# EAGLE schematic freebus_grundschaltung-transmitter (EAGLE 5.03)
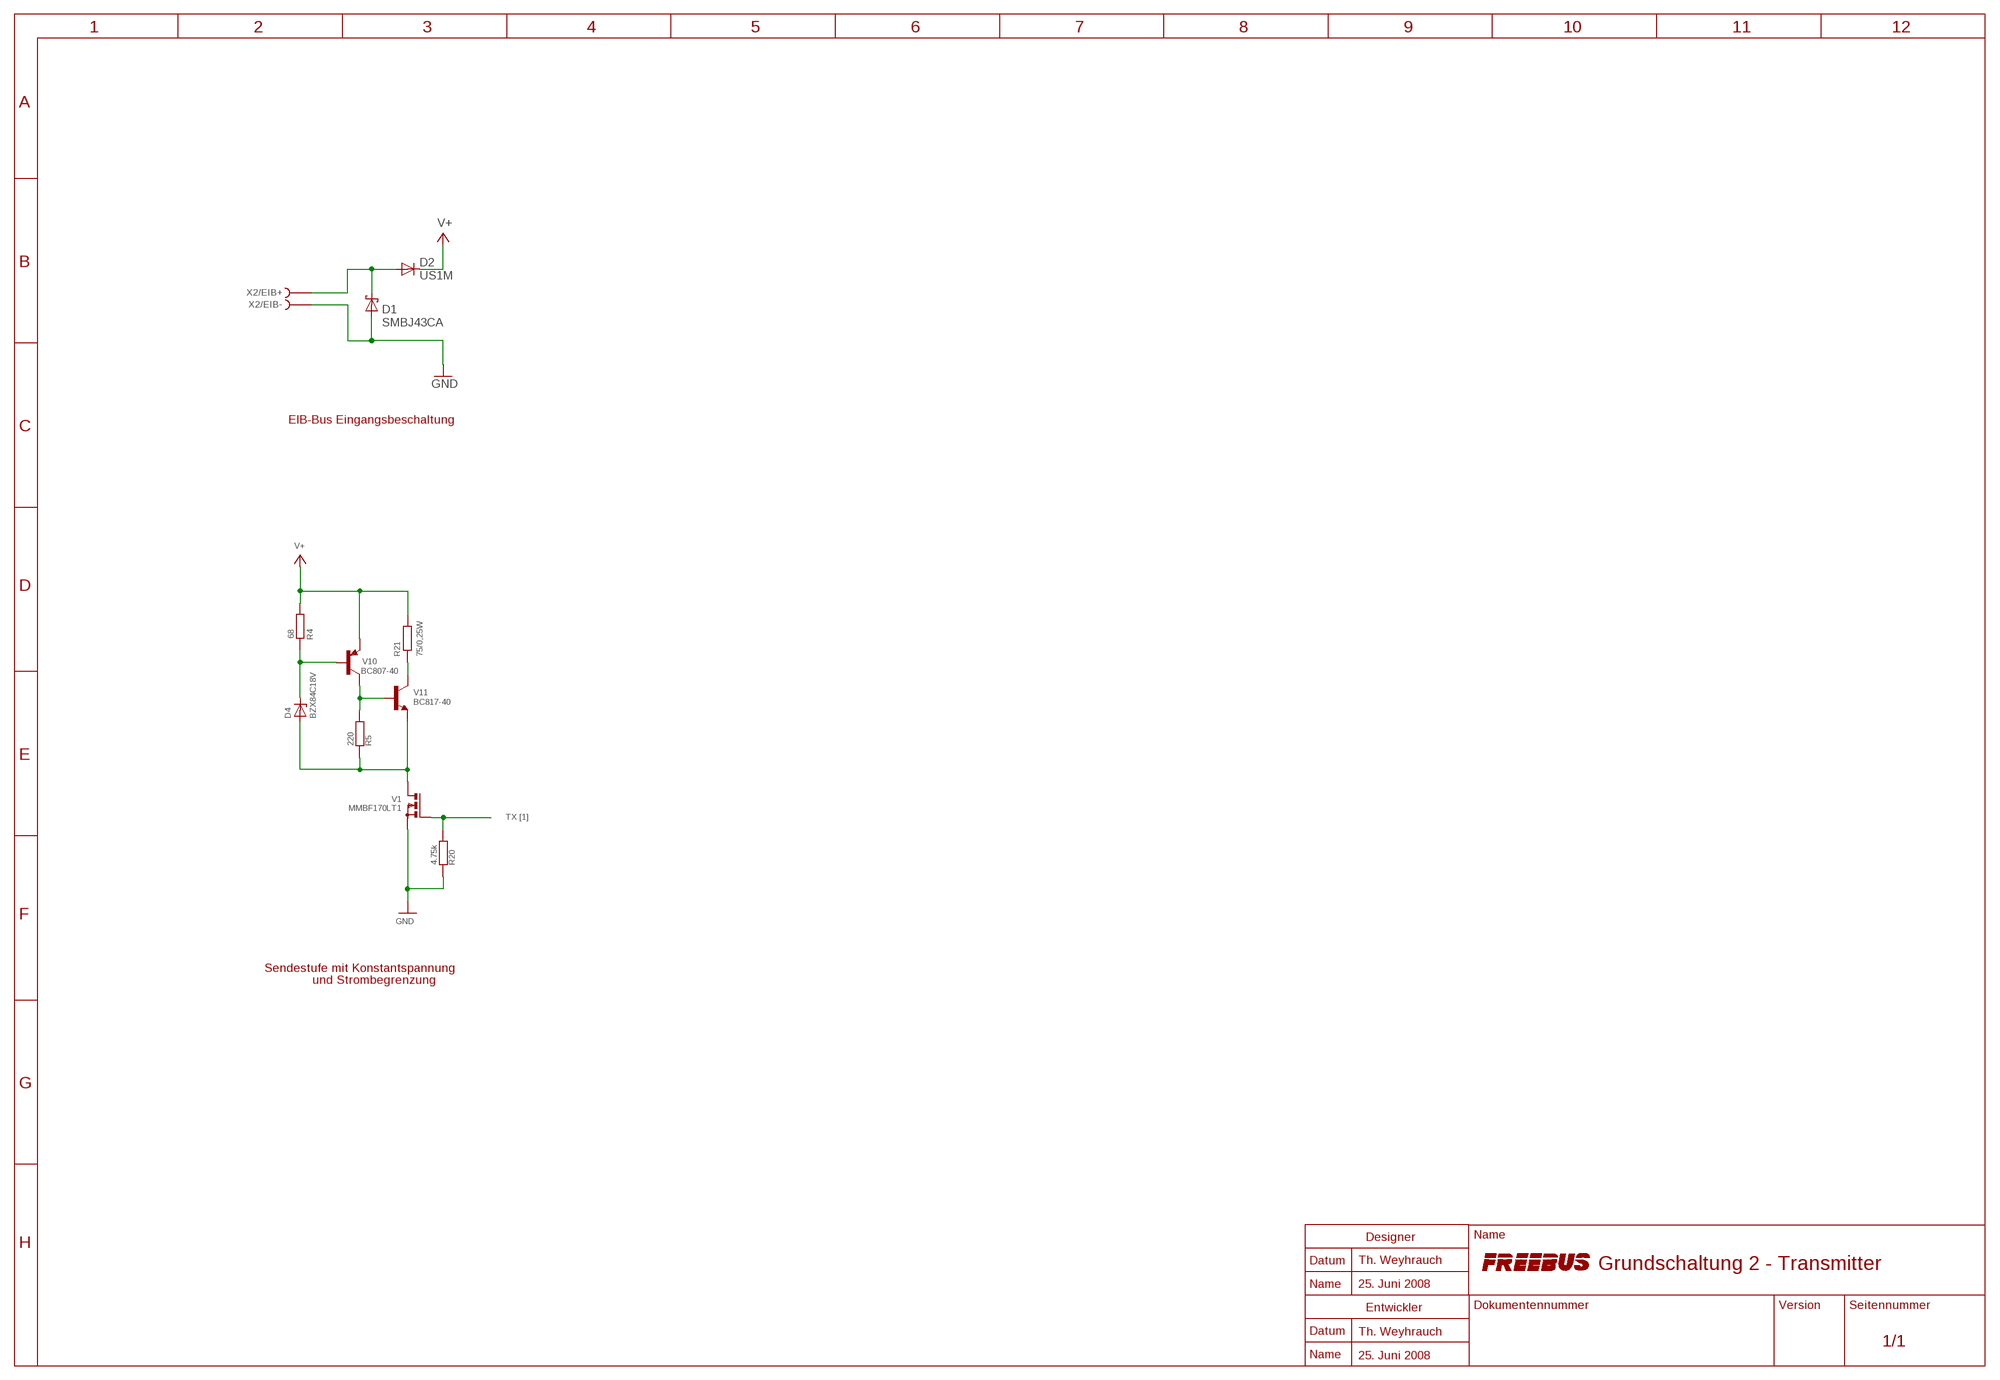
[diagram p0: schematic, sheet 1]

## Parts
D1  SMBJ43CA  SCHOTTKY-DIODESMD  [SMB]
D2  US1M  DIODE-DO214AC  [DO214AC]
D4  BZX84C18V  BZX84CSMD  [TO236]
R4  68  R-0805  [0805]
R5  220  R-0805  [0805]
R20  4.75k  R-0805  [0805]
R21  75/0,25W  R-EU_M1206  [M1206]
V1  MMBF170LT1  [SOT23]
V10  BC807-40  BC807-40SMD  [SOT23-BEC]
V11  BC817-40  BC817-40SMD  [SOT23-BEC]
X2  EIB-BUSKLEMME  [EIB-BUSKLEMME]

## Nets
EIB+: D1.C D2.A X2.+
GND: D1.A R20.1 V1.2(S) X2.-
N$1: D4.C R4.1 V10.B
N$3: D4.A R5.1 V1.3(D) V11.E
N$4: R5.2 V10.C V11.B
N$9: R21.1 V11.C
TX: R20.2 V1.1(G)
V+: D2.C R4.2 R21.2 V10.E

## Notes on the sheet
- EIB-Bus Eingangsbeschaltung
- Netzteil
- TX [1]
- Sendestufe mit Konstantspannung
- und Strombegrenzung
- Th. Weyhrauch
- Grundschaltung 2 - Transmitter
- 25. Juni 2008
- Th. Weyhrauch
- 25. Juni 2008

## Library data of the parts
D1 = diode:SCHOTTKY-DIODE: Schottky Diode
D2 = diode:DIODE-: DIODE
D4 = diode:BZX84CSMD: Z DIODE
R4 R5 R20 = weyhrauch:R
R21 = rcl:R-EU_: RESISTOR, European symbol
V1 = weyhrauch:MMBF170LT1: MMBF170LT1 ON Semiconductor SOT23; N-Channel-MOS-FET; 500mA, 50V, RDS(on) = 5Ohm
V10 = transistor-pnp:BC807*: PNP Transistror
V11 = transistor-npn:BC817*: NPN Transistor
X2 = Freebus:EIB-BUSKLEMME

## Net classes
1 power: width 0.406 mm